# Altium project Gateway.PrjPcb
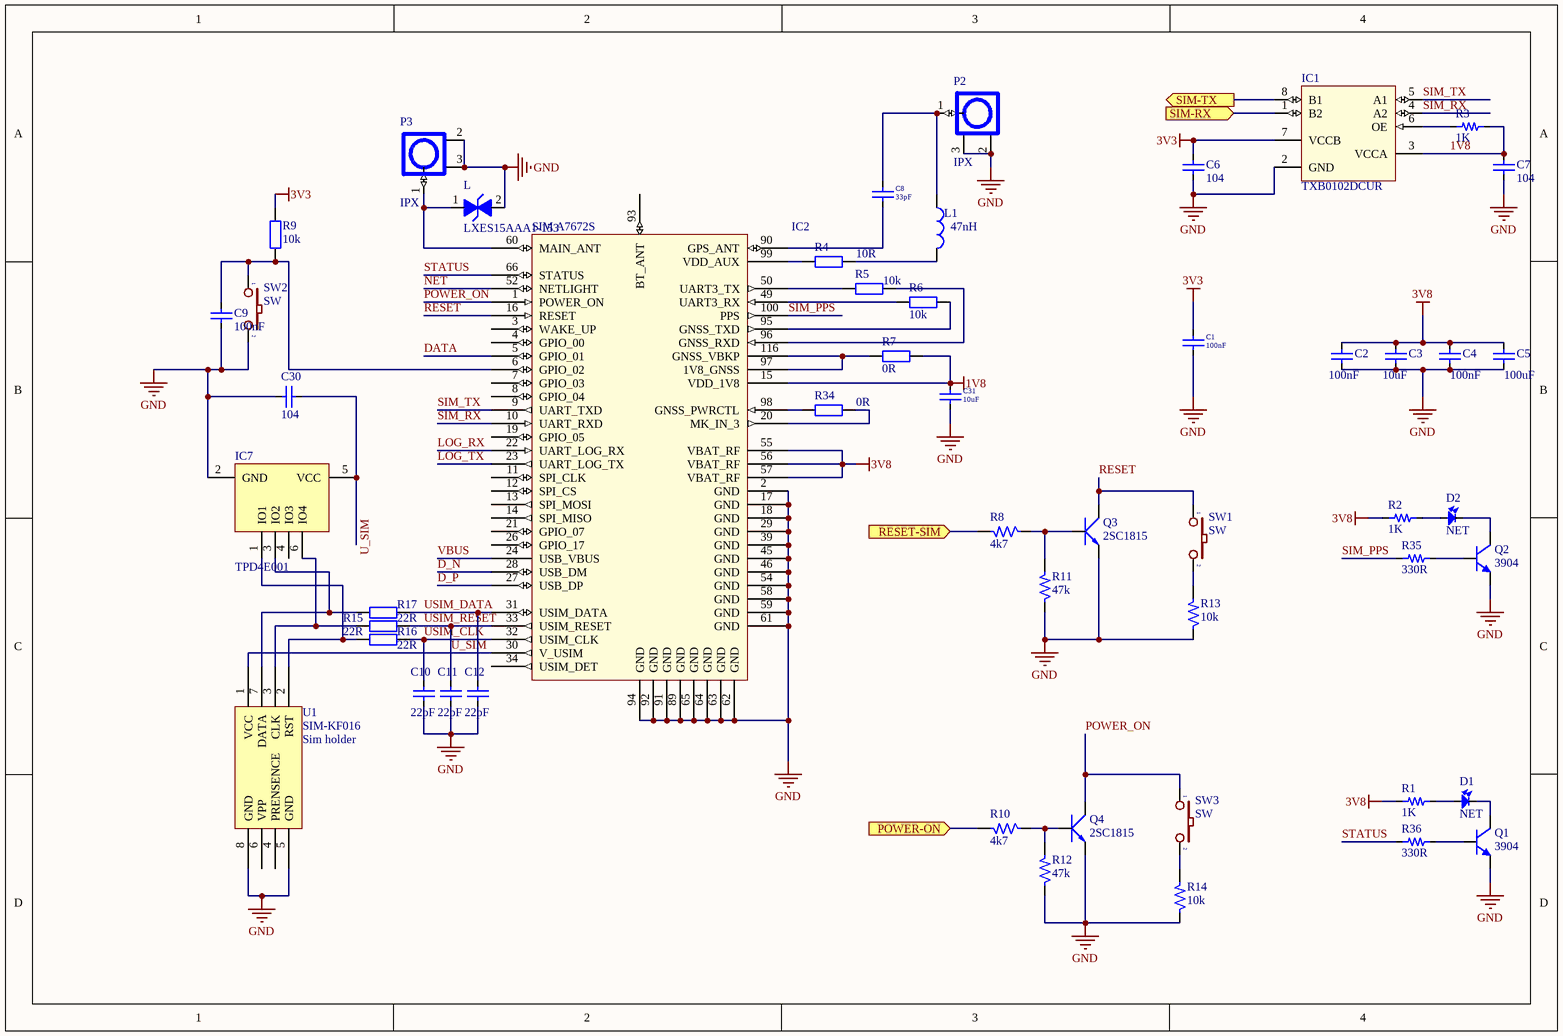
[diagram p0: 4G_GATEWAY.SchDoc]
3 sheets, 109 parts. Net scope: flat (ports and power ports of the same name join across sheets).
Board file: Gateway.PcbDoc
Sheets:
  4G_GATEWAY.SchDoc
  MCU_GATEWAY.SchDoc
  POWER_GATEWAY.SchDoc

## Sheet 4G_GATEWAY.SchDoc
size A4

### Parts
C1  100nF  [CAP_0805]
C2  100nF  [CAP_0805]
C3  10uF  [CAP_0805]
C4  100nF  [CAP_0805]
C5  100uF  [CAP_0805]
C6  104  [CAP_0805]
C7  104  [CAP_0805]
C8  33pF  [CAP_0805]
C9  100nF  [CAP_0805]
C10  22pF  [CAP_0805]
C11  22pF  [CAP_0805]
C12  22pF  [CAP_0805]
C30  104  [CAP_0805]
C31  10uF  [CAP_0805]
D1  NET  [LED-0805-Blue]
D2  NET  [LED-0805-Blue]
IC1  TXB0102DCUR  [SOP50P310X90-8N]
IC2  SIM A7672S  [A7672S]
IC7  TPD4E001  [SOT23-6]
L  LXES15AAA1-153  [INDC1005X45]
L1  47nH  [L-0805]
P2  IPX  [IPXS]
P3  IPX  [IPXS]
Q1  3904  [SOT23]
Q2  3904  [SOT23]
Q3  2SC1815  [SOT23]
Q4  2SC1815  [SOT23]
R1  1K  [RES-SMD-0805]
R2  1K  [RES-SMD-0805]
R3  1K  [RES-SMD-0805]
R4  10R  [RES-SMD-0805]
R5  10k  [RES-SMD-0805]
R6  10k  [RES-SMD-0805]
R7  0R  [RES-SMD-0805]
R8  4k7  [RES-SMD-0805]
R9  10k  [RES-SMD-0805]
R10  4k7  [RES-SMD-0805]
R11  47k  [RES-SMD-0805]
R12  47k  [RES-SMD-0805]
R13  10k  [RES-SMD-0805]
R14  10k  [RES-SMD-0805]
R15  22R  [RES-SMD-0805]
R16  22R  [RES-SMD-0805]
R17  22R  [RES-SMD-0805]
R34  0R  [RES-SMD-0805]
R35  330R  [RES-SMD-0805]
R36  330R  [RES-SMD-0805]
SW1  SW  [SW-SMD]
SW2  SW  [SW-SMD]
SW3  SW  [SW-SMD]
U1  SIM-KF016  value Sim holder  [SIM_MicroSIM 6P Flip]

### Ports
POWER-ON (in), RESET-SIM (in), SIM-RX (in), SIM-TX (out)

### Nets
1V8: C7.2 C31.2 IC1.3(VCCA) IC2.15(RESERVED) R3.2 R7.1
3V3: C1.2 C6.2 IC1.7(VCCB) R9.2
3V8: C2.2 C3.2 C4.2 C5.2 IC2.55(VBAT_RF) IC2.56(VBAT_RF) IC2.57(VBAT_RF) R1.1 R2.1
GND: C1.1 C2.1 C3.1 C4.1 C5.1 C6.1 C7.1 C9.1 C10.2 C11.2 C12.2 C30.2 C31.1 IC1.2(GND) IC2.2(GND) IC2.17(GND) IC2.18(GND) IC2.29(KEYPAD_0) IC2.39(GND) IC2.45(GND) IC2.46(ADC2) IC2.54(GPIO4) IC2.58(GND) IC2.59(GND) IC2.61(GND) IC2.62(GND) IC2.63(GND) IC2.64(GND) IC2.65(GND) IC2.89(GND) IC2.91(GND) IC2.92(GND) IC2.94(GND) IC7.2(GND) L.2 P2.2 P2.3 P3.2 P3.3 Q1.2(E) Q2.2(E) Q3.1(E) Q4.1(E) R11.1 R12.1 R13.1 R14.1 SW2.2 U1.5(GND) U1.8(GND)
D_N: IC2.28(KEYSENSE_N0)
D_P: IC2.27(KEYSENSE_N1)
DATA: IC2.5(GPIO_01)
LOG_RX: IC2.22(SPK_P)
LOG_TX: IC2.23(MIC1P)
NET: IC2.52(GPIO41)
POWER_ON: IC2.1(POWER_ON) Q4.2(C) SW3.1
RESET: IC2.16(RESERVED) Q3.2(C) SW1.1
SIM_PPS: IC2.100(PPS) R35.1
SIM_RX: IC1.4(A2) IC2.10(UART_RXD)
SIM_TX: IC1.5(A1) IC2.9(UART_TXD)
STATUS: IC2.66(STATUS) R36.1
U_SIM: C11.1 C30.1 IC2.30(KEYPAD_2) IC2.33(KEYPAD_1) IC7.5(VCC) R15.2 U1.1(VCC)  [also labelled USIM_RESET]
USIM_CLK: C10.1 IC2.32(KEYSENSE_N3) R16.1
USIM_DATA: C12.1 IC2.31(KEYSENSE_N2) R17.1
VBUS: IC2.24(MIC1N)
NetC8_1: C8.1 IC2.90(GPS_ANT)
NetC8_2: C8.2 L1.1 P2.1
NetC9_2: C9.2 IC2.6(GPIO_02) R9.1 SW2.1
NetD1_1: D1.1 R1.2
NetD1_2: D1.2 Q1.3(C)
NetD2_1: D2.1 R2.2
NetD2_2: D2.2 Q2.3(C)
NetIC1_1: IC1.1(B2) ; port SIM-RX
NetIC1_6: IC1.6(OE) R3.1
NetIC1_8: IC1.8(B1) ; port SIM-TX
NetIC2_20: IC2.20(MK_IN_3) R34.1
NetIC2_49: IC2.49(GPIO40) R6.2
NetIC2_50: IC2.50(GPIO43) R5.2
NetIC2_60: IC2.60(MAIN_ANT) L.1 P3.1
NetIC2_95: IC2.95(GNSS_TXD) R6.1
NetIC2_96: IC2.96(GNSS_RXD) R5.1
NetIC2_97: IC2.97(1V8_GNSS) IC2.116(GNSS_VBKP) R7.2
NetIC2_98: IC2.98(GNSS_PWRCTL) R34.2
NetIC2_99: IC2.99(VDD_AUX) R4.2
NetIC7_1: IC7.1(IO1) R16.2 U1.2(RST)
NetIC7_3: IC7.3(IO2) R17.2 U1.7(DATA)
NetIC7_6: IC7.6(IO4) R15.1 U1.3(CLK)
NetL1_2: L1.2 R4.1
NetQ1_1: Q1.1(B) R36.2
NetQ2_1: Q2.1(B) R35.2
NetQ3_3: Q3.3(B) R8.1 R11.2
NetQ4_3: Q4.3(B) R10.1 R12.2
NetR8_2: R8.2 ; port RESET-SIM
NetR10_2: R10.2 ; port POWER-ON
NetR13_2: R13.2 SW1.2
NetR14_2: R14.2 SW3.2

Not connected (* = marked no-connect by the designer): IC2 3(WAKE_UP) 4(GPIO_00) 7(GPIO_03) 8(GPIO_04) 11(SPI_CLK) 12(SPI_CS) 13(SPI_MOSI) 14(SPI_MISO) 19(GPIO_05) 21(SPK_M) 25(EAR1N) 26(EAR1P) 34(KEYPAD_4) 35(KEYPAD_3) 36(KEYSENSE_N4) 47(ADC1) 48(GPIO44) 51(GPIO1) 53(GPIO42) 73(PCM_DOUT) 74(PCM_DIN) 75(PCM_SYNC) 76(PCM_CLK) 93(BT_ANT); IC7 4(IO3); U1 4(PRENSENCE) 6(VPP)

### Library data of the parts
C1 = CapSMD_5: Capacitor; Value: 33p; Published: 8-Jun-2000; LatestRevisionDate: 17-Jul-2002; LatestRevisionNote: Re-released for DXP Platform.; PackageReference: RAD-0.3; Publisher: Altium Limited
C2-C7 = CapSMD_9: Capacitor; Value: 33p; Published: 8-Jun-2000; LatestRevisionDate: 17-Jul-2002; LatestRevisionNote: Re-released for DXP Platform.; PackageReference: RAD-0.3; Publisher: Altium Limited
C8 C31 = CapSMD_1: Capacitor; Value: 33p; Published: 8-Jun-2000; LatestRevisionDate: 17-Jul-2002; LatestRevisionNote: Re-released for DXP Platform.; PackageReference: RAD-0.3; Publisher: Altium Limited
C9-C12 C30 = CapSMD: Capacitor; Value: 33p; Published: 8-Jun-2000; LatestRevisionDate: 17-Jul-2002; LatestRevisionNote: Re-released for DXP Platform.; PackageReference: RAD-0.3; Publisher: Altium Limited
D1 D2 = LED_2: LED Single colour Green and Red; Value: LED 3 ly Single Colour
IC1 = TXB0102DCUR: IC TRNSLTR BIDIRECTIONAL US8; Manufacturer: Texas Instruments; Category: IC Logic Level; Package: 8-VSSOP; Part number: TXB0102DCUR; User_Description: IC TRNSLTR BIDIRECTIONAL US8
IC2 = SIM A7672S: SIM A7672S-CAT-M1; Part number: SIM A7672S
IC7 = TPD4E001_1: Manufacturer: Texas Instruments; Part number: TPD4E001RDBVR; User_Description: TVS DIODE 5.5VWM SC70-6; Category: Circuit Protection; Package: SOT-363
L = LXES15AAA1-153: Clamp Ipp Tvs Diode Surface Mount 1005; MF: Murata; SnapEDA_Link: https://www.snapeda.com/parts/LXES15AAA1-153/Murata%20Electronics%20North%20America/view-part/653473/?ref=snap; MP: LXES15AAA1-153; Value: *; Digi-Key_Part_Number: 490-13210-1-ND; Digi-Key_Purchase_URL: https://www.digikey.kr/product-detail/en/murata-electronics/LXES15AAA1-153/490-13210-1-ND/5843764?utm_source=snapeda&utm_medium=aggregator&utm_campaign=symbol; Package: 0402 Murata
L1 = L1: 22µH Shielded Inductor 1.65A 96mOhm Max Nonstandard; Manufacturer: Bourns Inc.; Part Number: SRR0745A-220M; Value: 220uH; User_Description: FIXED IND 22UH 1.65A 96 MOHM SMD; Category: INDUCTORS; Package: SMD
P2 P3 = IPXSx66: Antenna GSM GPS; Manufacturer: TE Connectivity AMP Connectors; Part number: 2334884-1; User_Description: UMCC MICRO-COAX RECEPTACLE, GEN; Category: Connectors; Package: SMD
Q1 Q2 = MMBT3904
Q3 Q4 = 2SC1815: NPN 600mW, ECB; Value: C1815
R1-R3 R35 R36 = Resistor - SMD: Resistor; Manufacturer: Generic Components; Class: Passive; Published: 08/06/2000; Publisher: Altium Hobart Technology Centre
R4-R7 R9 R15-R17 R34 = Resistor - SMD: Resistor SMD; Manufacturer: Generic Components; Class: Passive; Published: 08/06/2000; Publisher: Altium Hobart Technology Centre
R8 R10-R14 = R: Resistor 1/4W; Value: R1/4W - 1K
SW1-SW3 = SW2: Switch button 2 pin; Value: SW chip 2 pin
U1 = Sim holder: SIM Card Holder KF-016

## Sheet MCU_GATEWAY.SchDoc
size A
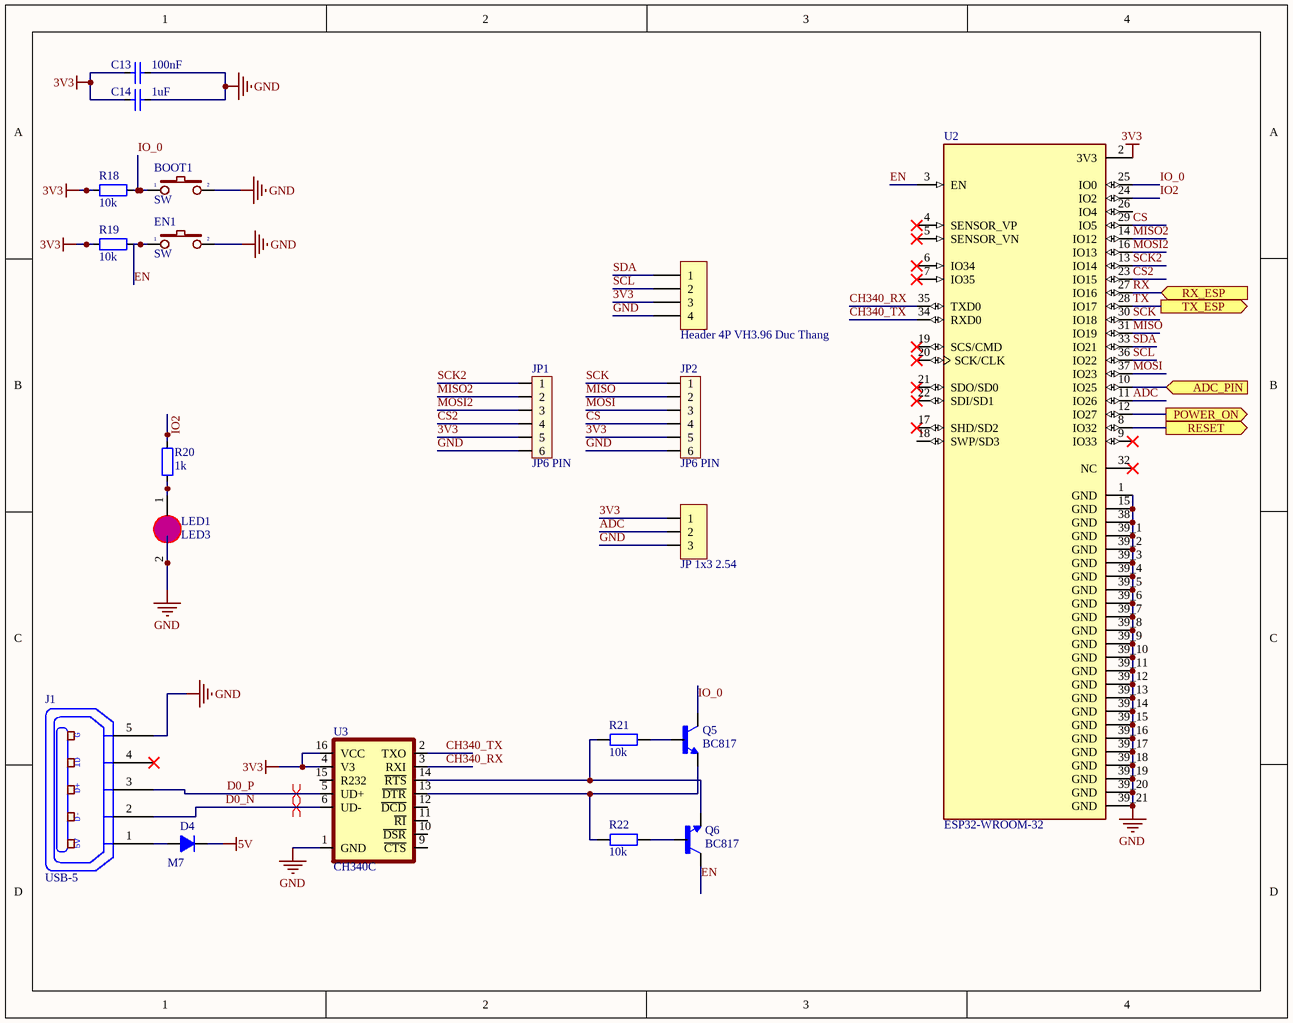
[diagram p1: MCU_GATEWAY.SchDoc]

### Parts
BOOT1  SW  [SW-SMD]
C13  100nF  [CAP_0805]
C14  1uF  [CAP_0805]
D4  M7  [SMA]
EN1  SW  [SW-SMD]
H1  Header 4P VH3.96 Duc Thang  [CON4]
J1  USB-5  [USB-M1]
JP1  JP6 PIN  [Header6]
JP2  JP6 PIN  [Header6]
JP3  JP 1x3 2.54  [JP3]
LED1  LED3  [LED0805]
Q5  BC817  [SOT95P240X97-3N]
Q6  BC817  [SOT95P240X97-3N]
R18  10k  [RES-SMD-0805]
R19  10k  [RES-SMD-0805]
R20  1k  [RES-SMD-0805]
R21  10k  [RES-SMD-0805]
R22  10k  [RES-SMD-0805]
U2  ESP32-WROOM-32  [MODULE_ESP32-WROOM-32]
U3  CH340C  [SOP-16]

### Ports
ADC_PIN (in), POWER_ON (out), RESET (out), RX_ESP (in), TX_ESP (out)

### Nets
3V3: C13.1 C14.1 H1.3 JP1.5 JP2.5 JP3.1 R18.1 R19.1 U2.2(3V3) U3.4(V3) U3.16(VCC)
5V: D4.2(K)
GND: BOOT1.2 C13.2 C14.2 EN1.2 H1.4 J1.5(P5) JP1.6 JP2.6 JP3.3 LED1.2(K) U2.1(GND) U2.15(GND) U2.38(GND) U2.39_1(GND) U2.39_2(GND) U2.39_3(GND) U2.39_4(GND) U2.39_5(GND) U2.39_6(GND) U2.39_7(GND) U2.39_8(GND) U2.39_9(GND) U2.39_10(GND) U2.39_11(GND) U2.39_12(GND) U2.39_13(GND) U2.39_14(GND) U2.39_15(GND) U2.39_16(GND) U2.39_17(GND) U2.39_18(GND) U2.39_19(GND) U2.39_20(GND) U2.39_21(GND) U3.1(GND)
ADC: JP3.2 U2.11(IO26)
CH340_RX: U2.35(TXD0) U3.3(RXI)
CH340_TX: U2.34(RXD0) U3.2(TXO)
CS: JP2.4 U2.29(IO5)
CS2: JP1.4 U2.23(IO15)
D0_N: J1.2(P2) U3.6(UD-)
D0_P: J1.3(P3) U3.5(UD+)
EN: EN1.1 Q6.3(C) R19.2 U2.3(EN)
IO2: R20.1 U2.24(IO2)
IO_0: BOOT1.1 Q5.3(C) R18.2 U2.25(IO0)
MISO: JP2.2 U2.31(IO19)
MISO2: JP1.2 U2.14(IO12)
MOSI: JP2.3 U2.37(IO23)
MOSI2: JP1.3 U2.16(IO13)
RX: U2.27(IO16) ; port RX_ESP
SCK: JP2.1 U2.30(IO18)
SCK2: JP1.1 U2.13(IO14)
SCL: H1.2 U2.36(IO22)
SDA: H1.1 U2.33(IO21)
TX: U2.28(IO17) ; port TX_ESP
NetD4_1: D4.1(A) J1.1(P1)
NetLED1_1: LED1.1(A) R20.2
NetQ5_1: Q5.1(B) R21.2
NetQ5_2: Q5.2(E) R22.1 U3.13(~{DTR})
NetQ6_1: Q6.1(B) R22.2
NetQ6_2: Q6.2(E) R21.1 U3.14(~{RTS})
NetU2_8: U2.8(IO32) ; port RESET
NetU2_10: U2.10(IO25) ; port ADC_PIN
NetU2_12: U2.12(IO27) ; port POWER_ON

Not connected (* = marked no-connect by the designer): J1 4(P4)*; U2 4(SENSOR_VP)* 5(SENSOR_VN)* 6(IO34)* 7(IO35)* 9(IO33)* 17(SHD/SD2)* 18(SWP/SD3) 19(SCS/CMD)* 20(SCK/CLK)* 21(SDO/SD0)* 22(SDI/SD1)* 26(IO4) 32(NC)*; U3 9(~{CTS}) 10(~{DSR}) 11(~{RI}) 12(~{DCD}) 15(R232)

### Layout directives
differential pair: D0_N, D0_P

### Notes on the sheet
- (in symbol USB-5) G; ID; D+; D-; 5V

### Library data of the parts
BOOT1 EN1 = SW2: as SW1 on sheet 4G_GATEWAY
C13 C14 = CapSMD: Capacitor; Value: 33p; Published: 8-Jun-2000; LatestRevisionDate: 17-Jul-2002; LatestRevisionNote: Re-released for DXP Platform.; PackageReference: RAD-0.3; Publisher: Altium Limited
D4 = D1A: Diode 1A; Value: 1N4007
H1 = Header 4P VH3.96 Duc Thang: Cắm; Ten_Linh_Kien: Header 4P XH2.54-4P Đực Thẳng; Don_Vi: Con; Ma_Hang: MH001285; Chung_Loai: Cắm
J1 = USB-5: Manufacturer: FCI; Manufacturer Part Number: 10118193-0001LF; Connector Type: USB - micro B; Number of Contacts: 5; Gender: Receptacle; Specifications: USB 2.0; .Creator: MM; .Checked PCB: RF; Supplier 1: Digi-Key; RoHS: RoHS Compliant; Category: Connectors, Interconnects; Stock 1: 28642; Pricing 1: 1=0.46, 10=0.433, 25=0.3712, 50=0.3156, 100=0.3032, 250=0.27224, 500=0.25988 (USD); Packaging: Cut Tape (CT); Mounting Type: Surface Mount, Right Angle, Horizontal; Features: Shielded, Solder Retention; Ingress Protection: -; ComponentLink1URL: http://portal.fciconnect.com/Comergent//fci/drawing/10118193.pdf; ComponentLink1Description: http://portal.fciconnect.com/Comergent//fci/drawing/10118193.pdf; Supplier Part Number 1: 609-4616-1-ND; .Checked SCH: MM
JP1 JP2 = JP6: Value: JP7
JP3 = JP 1x3 2.54 Cai Thang: Cắm; Ten_Linh_Kien: Jump Đơn Cái 2.54MM 1x20P Thẳng; Don_Vi: Con; Ma_Hang: MH004006; Ghi_Chu: *; Kieu_Chan: *; Chung_Loai: Cắm
LED1 = LED0805: LED SMD 0805
Q5 Q6 = BC817: Bipolar (BJT) Transistor NPN 45V 500mA 100MHz 250mW Surface Mount TO-236AB; MF: Rectron; MP: BC817; Value: *; SnapEDA_Link: https://www.snapeda.com/parts/BC817/Rectron/view-part/?ref=snap; Availability: In Stock; Purchase-URL: https://pricing.snapeda.com/search/part/BC817/?ref=eda; Package: SOT-23-3 Rectron; Price: None; Check_prices: https://www.snapeda.com/parts/BC817/Rectron/view-part/?ref=eda
R18-R22 = Resistor - SMD: as R4 on sheet 4G_GATEWAY; Published: 08/06/2000; Publisher: Altium Hobart Technology Centre
U2 = ESP32-WROOM-32: Bluetooth, WiFi 802.11b/g/n, Bluetooth v4.2 +EDR, Class 1, 2 and 3 Transceiver Module 2.4GHz ~ 2.5GHz Antenna Not Included, U.FL Surface Mount; MF: Espressif Systems; Price: None; Availability: In Stock; MP: ESP32-WROOM-32; Package: Module Espressif Systems; SnapEDA_Link: https://www.snapeda.com/parts/ESP32-WROOM-32/Espressif+Systems/view-part/?ref=snap; Check_prices: https://www.snapeda.com/parts/ESP32-WROOM-32/Espressif+Systems/view-part/?ref=eda; Value: *; Purchase-URL: https://pricing.snapeda.com/search/part/ESP32-WROOM-32/?ref=eda
U3 = CH340C: USB to serial chip CH340; MF: WCH; Package: Package; Check_prices: https://www.snapeda.com/parts/CH340C/WCH/view-part/5428851/?ref=eda; Value: *; Price: None; MP: CH340C; Availability: Unavailable; SnapEDA_Link: https://www.snapeda.com/parts/CH340C/WCH/view-part/5428851/?ref=snap

## Sheet POWER_GATEWAY.SchDoc
size A4
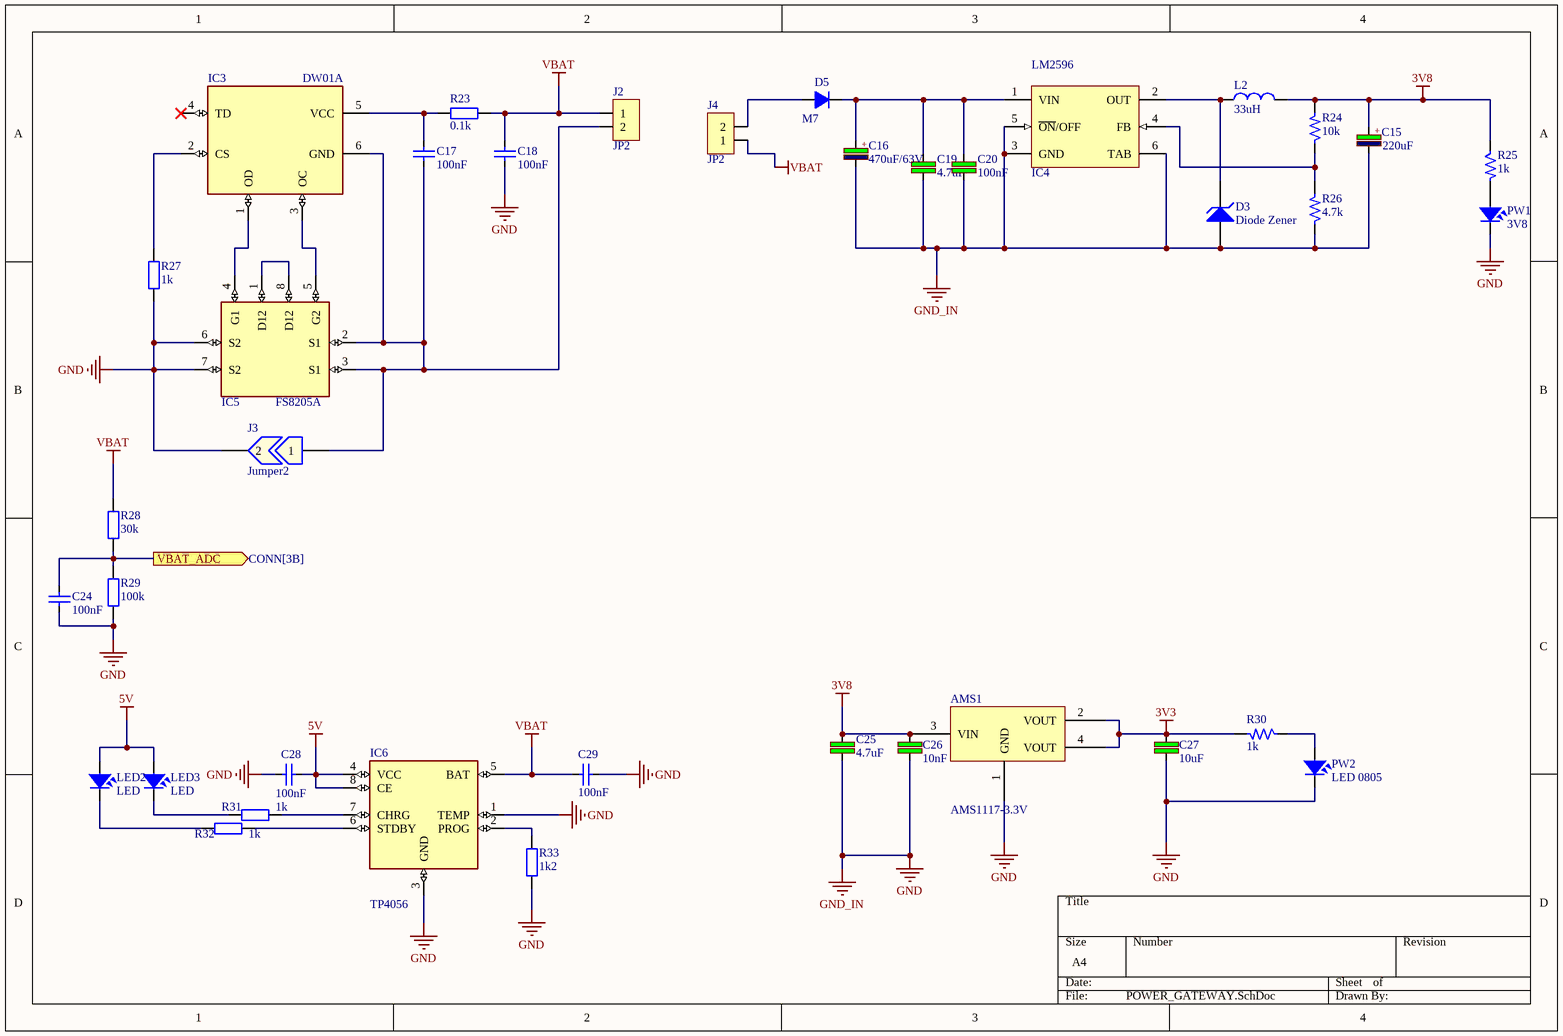
[diagram p2: POWER_GATEWAY.SchDoc]

### Parts
AMS1  AMS1117-3.3V  [SOT223]
C15  220uF  [CAP_TANTALUM_3216]
C16  470uF/63V  [CAP-ALU-SMD-C]
C17  100nF  [CAP_0805]
C18  100nF  [CAP_0805]
C19  4.7uF  [C-0805]
C20  value 100nF  [C-0805]  (hidden comment: 4.7uF)
C24  100nF  [CAP_0805]
C25  4.7uF  [C-0805]
C26  10nF  [C-0805]
C27  10uF  [C-0805]
C28  100nF  [CAP_0805]
C29  100nF  [CAP_0805]
D3  Diode Zener  [DIODE_ZENER_SMD]
D5  M7  [SMA]
IC3  DW01A  [SOT23-6]
IC4  LM2596  [TO-263]
IC5  FS8205A  [FS8205A]
IC6  TP4056  [TP4056]
J2  JP2  [KF2-5.08]
J3  Jumper2  [JUMPER2]
J4  JP2  [KF2-5.08]
L2  33uH  [Inductor_SMD]
LED2  LED  [LED-0805-Blue]
LED3  LED  [LED-0805-Blue]
PW1  3V8  [LED-0805-Blue]
PW2  LED 0805  [LED-0805-Blue]
R23  0.1k  [RES-SMD-0805]
R24  10k  [R-0805]
R25  1k  [R-0805]
R26  4.7k  [R-0805]
R27  1k  [RES-SMD-0805]
R28  30k  [RES-SMD-0805]
R29  100k  [RES-SMD-0805]
R30  1k  [R-0805]
R31  1k  [RES-SMD-0805]
R32  1k  [RES-SMD-0805]
R33  1k2  [RES-SMD-0805]

### Ports
VBAT_ADC (out, see CONN[3B])

### Nets
3V3: AMS1.2(VOUT) AMS1.4(VOUT) C27.1 R30.2
3V8: AMS1.3(VIN) C15.1 C25.2 C26.1 L2.2 R24.2 R25.1
5V: C28.1 IC6.4(VCC) IC6.8(CE) LED2.1 LED3.1
GND: AMS1.1(GND) C15.2 C16.2 C18.1 C19.1 C20.1 C24.1 C25.1 C26.2 C27.2 C28.2 C29.1 D3.1(A) IC4.3(GND) IC4.5(~{ON}/OFF) IC4.6(TAB) IC5.6(S2) IC5.7(S2) IC6.1(TEMP) IC6.3(GND) J3.2 PW1.2 PW2.2 R26.1 R27.2 R29.1 R33.2  [also labelled GND_IN]
VBAT: C18.2 C29.2 IC6.5(BAT) J2.1 J4.1 R23.2 R28.2
NetC16_1: C16.1 C19.2 C20.2 D5.2(K) IC4.1(VIN)
NetC17_1: C17.1 IC3.6(GND) IC5.2(S1) IC5.3(S1) J2.2 J3.1
NetC17_2: C17.2 IC3.5(VCC) R23.1
NetC24_2: C24.2 R28.1 R29.2 ; port VBAT_ADC
NetD3_2: D3.2(K) IC4.2(OUT) L2.1
NetD5_1: D5.1(A) J4.2
NetIC3_1: IC3.1(OD) IC5.4(G1)
NetIC3_2: IC3.2(CS) R27.1
NetIC3_3: IC3.3(OC) IC5.5(G2)
NetIC4_4: IC4.4(FB) R24.1 R26.2
NetIC5_1: IC5.1(D12) IC5.8(D12)
NetIC6_2: IC6.2(PROG) R33.1
NetIC6_6: IC6.6(STDBY) R32.2
NetIC6_7: IC6.7(CHRG) R31.2
NetLED2_2: LED2.2 R32.1
NetLED3_2: LED3.2 R31.1
NetPW1_1: PW1.1 R25.2
NetPW2_1: PW2.1 R30.1

Not connected (* = marked no-connect by the designer): IC3 4(TD)*

### Notes on the sheet
- (in symbol CP3) +
- (in symbol CP5) +

### Library data of the parts
AMS1 = AMS1117 SMD: Dán; Value: AMS1117-3.3V SOT223; Don_Vi: Con; Ma_Hang: MH000596; Ghi_Chu: *; Kieu_Chan: *; Chung_Loai: Dán
C15 = CP5: 220µF Molded Tantalum Polymer Capacitor 16V 2917 (7343 Metric) 40mOhm @ 100kHz; Manufacturer: AVX Corporation; Part number: TCME227M016R0040E; User_Description: CAP TANT POLY 220UF 16V 2917; Value: 220uF; Category: CAPACITOR; Package: 2917
C16 = CP3: Cap 470uF/63V; Value: Cap 470uF/63V
C17 C18 C24 C28 C29 = CapSMD: Capacitor; Value: 33p; Published: 8-Jun-2000; LatestRevisionDate: 17-Jul-2002; LatestRevisionNote: Re-released for DXP Platform.; PackageReference: RAD-0.3; Publisher: Altium Limited
C19 C20 C25 = C: 4.7µF ±10% 35V Ceramic Capacitor X5R 0805 (2012 Metric); Manufacturer: Samsung Electro-Mechanics; Part number: CL21A475KLCLQNC; User_Description: CAP CER 4.7UF 35V X5R 0805; Category: CAPACITOR; Package: 0805
  C19 C25: Value: 4.7uF
C26 = C: Cap SMD; Manufacturer: Samsung Electro-Mechanics; Part number: CL21A106KPFNNNG; Value: 10uF; User_Description: CAP CER 10UF 10V X5R 0805; Category: CAPACITOR; Package: 0805
C27 = C: Cap SMD; Manufacturer: Samsung Electro-Mechanics; Part number: CL21A106KPFNNNG; User_Description: CAP CER 10UF 10V X5R 0805; Value: 10uF; Category: CAPACITOR; Package: 0805
D3 = Diode Zener: Zener Diode; Published: 8-Jun-2000; LatestRevisionDate: 17-Jul-2002; LatestRevisionNote: Re-released for DXP Platform.; PackageReference: DIODE-0.7; Publisher: Altium Limited
D5 = D1A: Diode 1A; Value: 1N4007
IC3 = DW01A: One Cell Lithium-ion/Polymer Battery Protection IC
IC4 = LM2576
IC6 = TP4056: Complete single cell Li-Ion battery with a constant current / constant voltage linear charger
J2 J4 = JP2: WR-PHD 2.54 mm Angled Socket Header; Manufacturer: W¨¹rth Elektronik eiSos GmbH; partNo: 613002143121; ComponentLink1 Description: Manufacturer; ComponentLink2 Description: Datasheet; NoPins: 02; Created Date: 29 March 2013; ComponentLink1URL: http://www.we-online.com; ComponentLink2URL: http://katalog.we-online.de/em/datasheet/6130xx143121.pdf; Created by: Karrer Zheng
J3 = Jumper2: Jumper, 2-Pin
L2 = L1: as L1 on sheet 4G_GATEWAY; Category: INDUCTORS; Package: SMD
LED2 LED3 = LED: LED Single colour Green and Red; Value: LED 3 ly Single Colour
PW1 PW2 = LED: LED RED DIFFUSED 0805 SMD; Manufacturer: OSRAM Opto Semiconductors Inc.; Part number: LS R976-NR-1; Value: Red; Category: LED SMD; Package: 0805; User_Description: LED RED DIFFUSED 0805 SMD
R23 R27-R29 R31-R33 = Resistor - SMD: as R4 on sheet 4G_GATEWAY; Published: 08/06/2000; Publisher: Altium Hobart Technology Centre
R24 = R: RES SMD 10K OHM 1% 1/8W 0805; Manufacturer: Yageo; Part number: RC0805FR-0710KL; Category: RESISTORS; Package: 0805; User_Description: RES SMD 10K OHM 1% 1/8W 0805; Value: 10k
R25 R30 = R: Resistor 1/4W; Manufacturer: Yageo; Part number: RC0805FR-071KL; User_Description: RES SMD 1K OHM 1% 1/8W 0805; Value: 1k; Category: RESISTORS; Package: 0805
R26 = R: RES SMD 3.3K OHM 1% 1/8W 0805; Manufacturer: Yageo; Part number: RC0805FR-073K3L; Category: RESISTORS; Package: 0805; User_Description: RES SMD 3.3K OHM 1% 1/8W 0805; Value: 3.3k

## Nets that join several sheets
3V3: 4G_GATEWAY (C1.2 C6.2 IC1.7 R9.2), MCU_GATEWAY (11 pins), POWER_GATEWAY (AMS1.2 AMS1.4 C27.1 R30.2)
3V8: 4G_GATEWAY (9 pins), POWER_GATEWAY (7 pins)
5V: MCU_GATEWAY (D4.2), POWER_GATEWAY (5 pins)
GND: 4G_GATEWAY (50 pins), MCU_GATEWAY (35 pins), POWER_GATEWAY (27 pins)